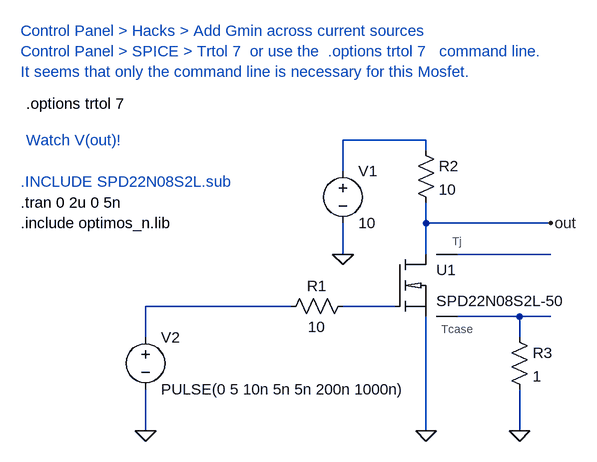
[diagram p0: schematic infineon_xnmos5_test_trtol7.asc]
infineon_xnmos5_test_trtol7.asc, the LTspice schematic file:
Version 4
SHEET 1 880 680
WIRE 80 176 160 176
WIRE 0 176 -224 176
WIRE 80 -32 80 -80
WIRE 80 -80 208 -80
WIRE 208 -80 208 -64
WIRE 80 48 80 96
WIRE 208 192 208 368
WIRE -224 224 -224 176
WIRE -224 304 -224 368
WIRE 208 16 208 48
WIRE 208 48 400 48
WIRE 208 48 208 96
WIRE 256 96 400 96
WIRE 256 192 352 192
WIRE 352 224 352 192
WIRE 352 192 400 192
WIRE 352 304 352 368
FLAG 80 96 0
FLAG -224 368 0
FLAG 208 368 0
FLAG 400 48 out
FLAG 352 368 0
SYMBOL res -16 192 R270
WINDOW 0 32 56 VTop 0
WINDOW 3 0 56 VBottom 0
SYMATTR InstName R1
SYMATTR Value 10
SYMBOL D:\\WUTemp\\Infineon\\xnmos5 160 96 R0
SYMATTR InstName U1
SYMATTR SpiceModel SPD22N08S2L-50
SYMBOL voltage 80 -48 R0
SYMATTR InstName V1
SYMATTR Value 10
SYMBOL res 192 -80 R0
SYMATTR InstName R2
SYMATTR Value 10
SYMBOL voltage -224 208 R0
WINDOW 123 0 0 Left 0
WINDOW 39 0 0 Left 0
SYMATTR InstName V2
SYMATTR Value PULSE(0 5 10n 5n 5n 200n 1000n)
SYMBOL res 336 208 R0
SYMATTR InstName R3
SYMATTR Value 1
TEXT -416 16 Left 0 !.tran 0 2u 0 5n
TEXT -416 -16 Left 0 ;.INCLUDE SPD22N08S2L.sub
TEXT -416 48 Left 0 !.include optimos_n.lib
TEXT -408 -80 Left 0 ;Watch V(out)!
TEXT -416 -248 Left 0 ;Control Panel > Hacks > Add Gmin across current sources\nControl Panel > SPICE > Trtol 7  or use the  .options trtol 7   command line.\nIt seems that only the command line is necessary for this Mosfet.
TEXT -408 -136 Left 0 !.options trtol 7

The netlist it stands for:
* infineon_xnmos5_test_trtol7.asc
R1 N002 N001 10
XU1 out N001 0 N004 N005 SPD22N08S2L-50  ; pins D G S Tj Tcase
V1 N003 0 10
R2 N003 out 10
V2 N002 0 PULSE(0 5 10n 5n 5n 200n 1000n)
R3 N005 0 1
.tran 0 2u 0 5n
* .INCLUDE SPD22N08S2L.sub
.include optimos_n.lib
* Watch V(out)!
* Control Panel > Hacks > Add Gmin across current sources
* Control Panel > SPICE > Trtol 7  or use the  .options trtol 7   command line.
* It seems that only the command line is necessary for this Mosfet.
.options trtol 7
.backanno
.end